# Altium schematic sheet Automat.SchDoc
size A
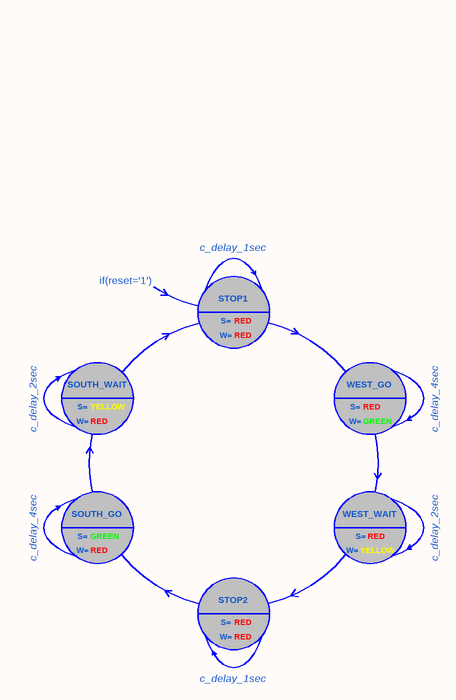
[diagram p0: Automat.SchDoc]

## Notes on the sheet
- if(reset='1')
- c_delay_1sec
- S=
- W=
- STOP1
- RED
- c_delay_2sec
- YELLOW
- SOUTH_WAIT
- WEST_GO
- c_delay_4sec
- GREEN
- SOUTH_GO
- WEST_WAIT
- STOP2